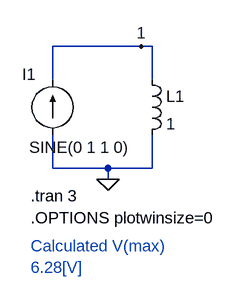
[diagram p0: schematic Fig_6-4_L_di-dt_SIN.asc]
Fig_6-4_L_di-dt_SIN.asc, the LTspice schematic file:
Version 4
SHEET 1 880 680
WIRE 192 112 64 112
WIRE 208 112 192 112
WIRE 64 160 64 112
WIRE 208 160 208 112
WIRE 64 288 64 240
WIRE 144 288 64 288
WIRE 208 288 208 240
WIRE 208 288 144 288
WIRE 144 304 144 288
FLAG 144 304 0
FLAG 192 112 1
SYMBOL ind 192 144 R0
SYMATTR InstName L1
SYMATTR Value 1
SYMBOL current 64 240 R180
WINDOW 0 24 88 Left 2
WINDOW 3 -112 -18 Left 2
WINDOW 123 0 0 Left 2
WINDOW 39 0 0 Left 2
SYMATTR InstName I1
SYMATTR Value SINE(0 1 1 0)
TEXT 32 328 Left 2 !.tran 3
TEXT 32 360 Left 2 !.OPTIONS plotwinsize=0
TEXT 32 400 Left 2 ;Calculated V(max)\n6.28[V]

The netlist it stands for:
* Fig_6-4_L_di-dt_SIN.asc
L1 1 0 1
I1 0 1 SINE(0 1 1 0)
.tran 3
.OPTIONS plotwinsize=0
* Calculated V(max)
* 6.28[V]
.backanno
.end